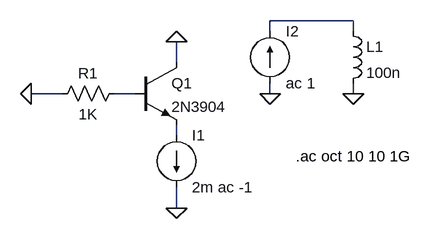
[diagram p0: schematic Draft1.asc]
Draft1.asc, the LTspice schematic file:
Version 4
SHEET 1 880 680
WIRE 560 48 432 48
WIRE 432 64 432 48
WIRE 560 64 560 48
WIRE 288 112 288 80
WIRE 112 160 64 160
WIRE 224 160 192 160
WIRE 432 160 432 144
WIRE 560 160 560 144
WIRE 288 224 288 208
WIRE 288 336 288 304
FLAG 64 160 0
FLAG 288 336 0
FLAG 288 80 0
FLAG 432 160 0
FLAG 560 160 0
SYMBOL npn 224 112 R0
SYMATTR InstName Q1
SYMATTR Value 2N3904
SYMBOL res 208 144 R90
WINDOW 0 0 56 VBottom 2
WINDOW 3 32 56 VTop 2
SYMATTR InstName R1
SYMATTR Value 1K
SYMBOL current 288 224 R0
SYMATTR InstName I1
SYMATTR Value 2m ac -1
SYMBOL ind 544 48 R0
SYMATTR InstName L1
SYMATTR Value 100n
SYMATTR SpiceLine Rser=15 Rpar=150 Cpar=2p
SYMBOL current 432 144 M180
WINDOW 0 24 80 Left 2
WINDOW 3 24 0 Left 2
SYMATTR InstName I2
SYMATTR Value ac 1
TEXT 472 256 Left 2 !.ac oct 10 10 1G

The netlist it stands for:
* Draft1.asc
Q1 0 N002 N003 0 2N3904
R1 N002 0 1K
I1 N003 0 2m ac -1
L1 N001 0 100n Rser=15 Rpar=150 Cpar=2p
I2 0 N001 ac 1
.model NPN NPN
.model PNP PNP
.lib standard.bjt
.ac oct 10 10 1G
.backanno
.end